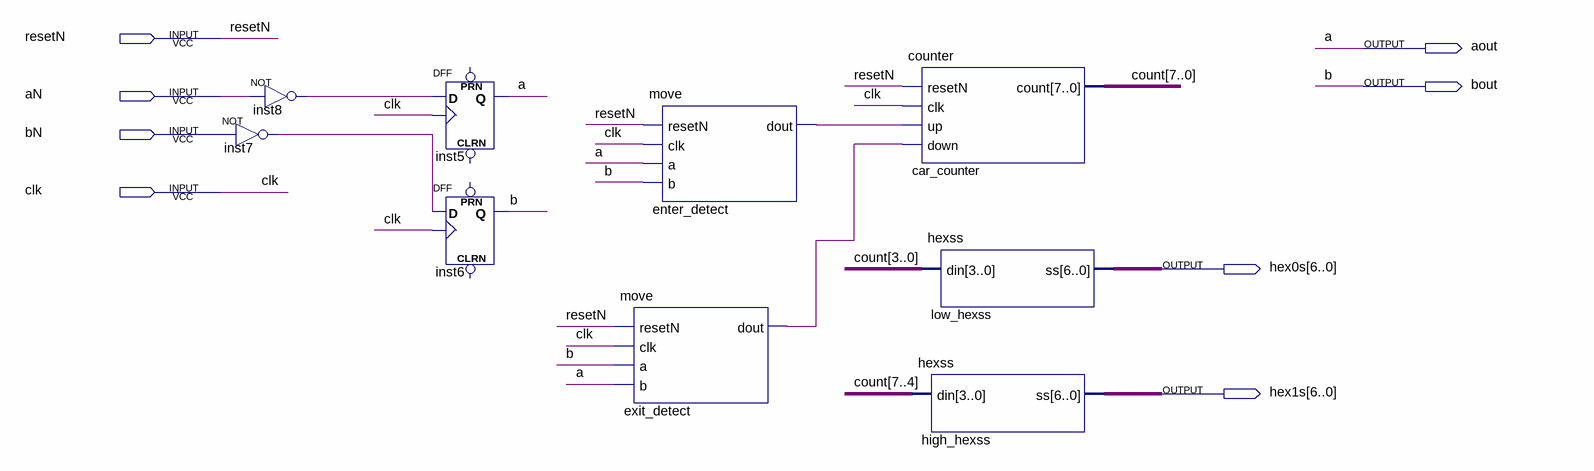
[diagram p0: schematic sheet]
// Quartus schematic parking.bdf as structural Verilog: 9 symbols, 8 pins
module parking (
  input  resetN,
  input  aN,
  input  bN,
  input  clk,
  output aout,
  output bout,
  output [6:0] hex0s,
  output [6:0] hex1s
);

  wire enter_detect_dout, exit_detect_dout, inst7_out, inst8_out;
  wire [7:0] count;

  not inst7 (inst7_out, bN);
  not inst8 (inst8_out, aN);
  DFF inst5 (.CLK(clk), .D(inst8_out), .Q(aout));  // open: CLRN, PRN
  DFF inst6 (.CLK(clk), .D(inst7_out), .Q(bout));  // open: CLRN, PRN
  move enter_detect (.resetN(resetN), .clk(clk), .a(aout), .b(bout), .dout(enter_detect_dout));
  move exit_detect (.resetN(resetN), .clk(clk), .a(bout), .b(aout), .dout(exit_detect_dout));
  counter car_counter (.resetN(resetN), .clk(clk), .up(enter_detect_dout), .down(exit_detect_dout), .count(count));
  hexss high_hexss (.din(count[7:4]), .ss(hex1s));
  hexss low_hexss (.din(count[3:0]), .ss(hex0s));

  // Other names for the same wires on the sheet: a = aout; b = bout
endmodule
